# Altium project mainboard.PrjPcb
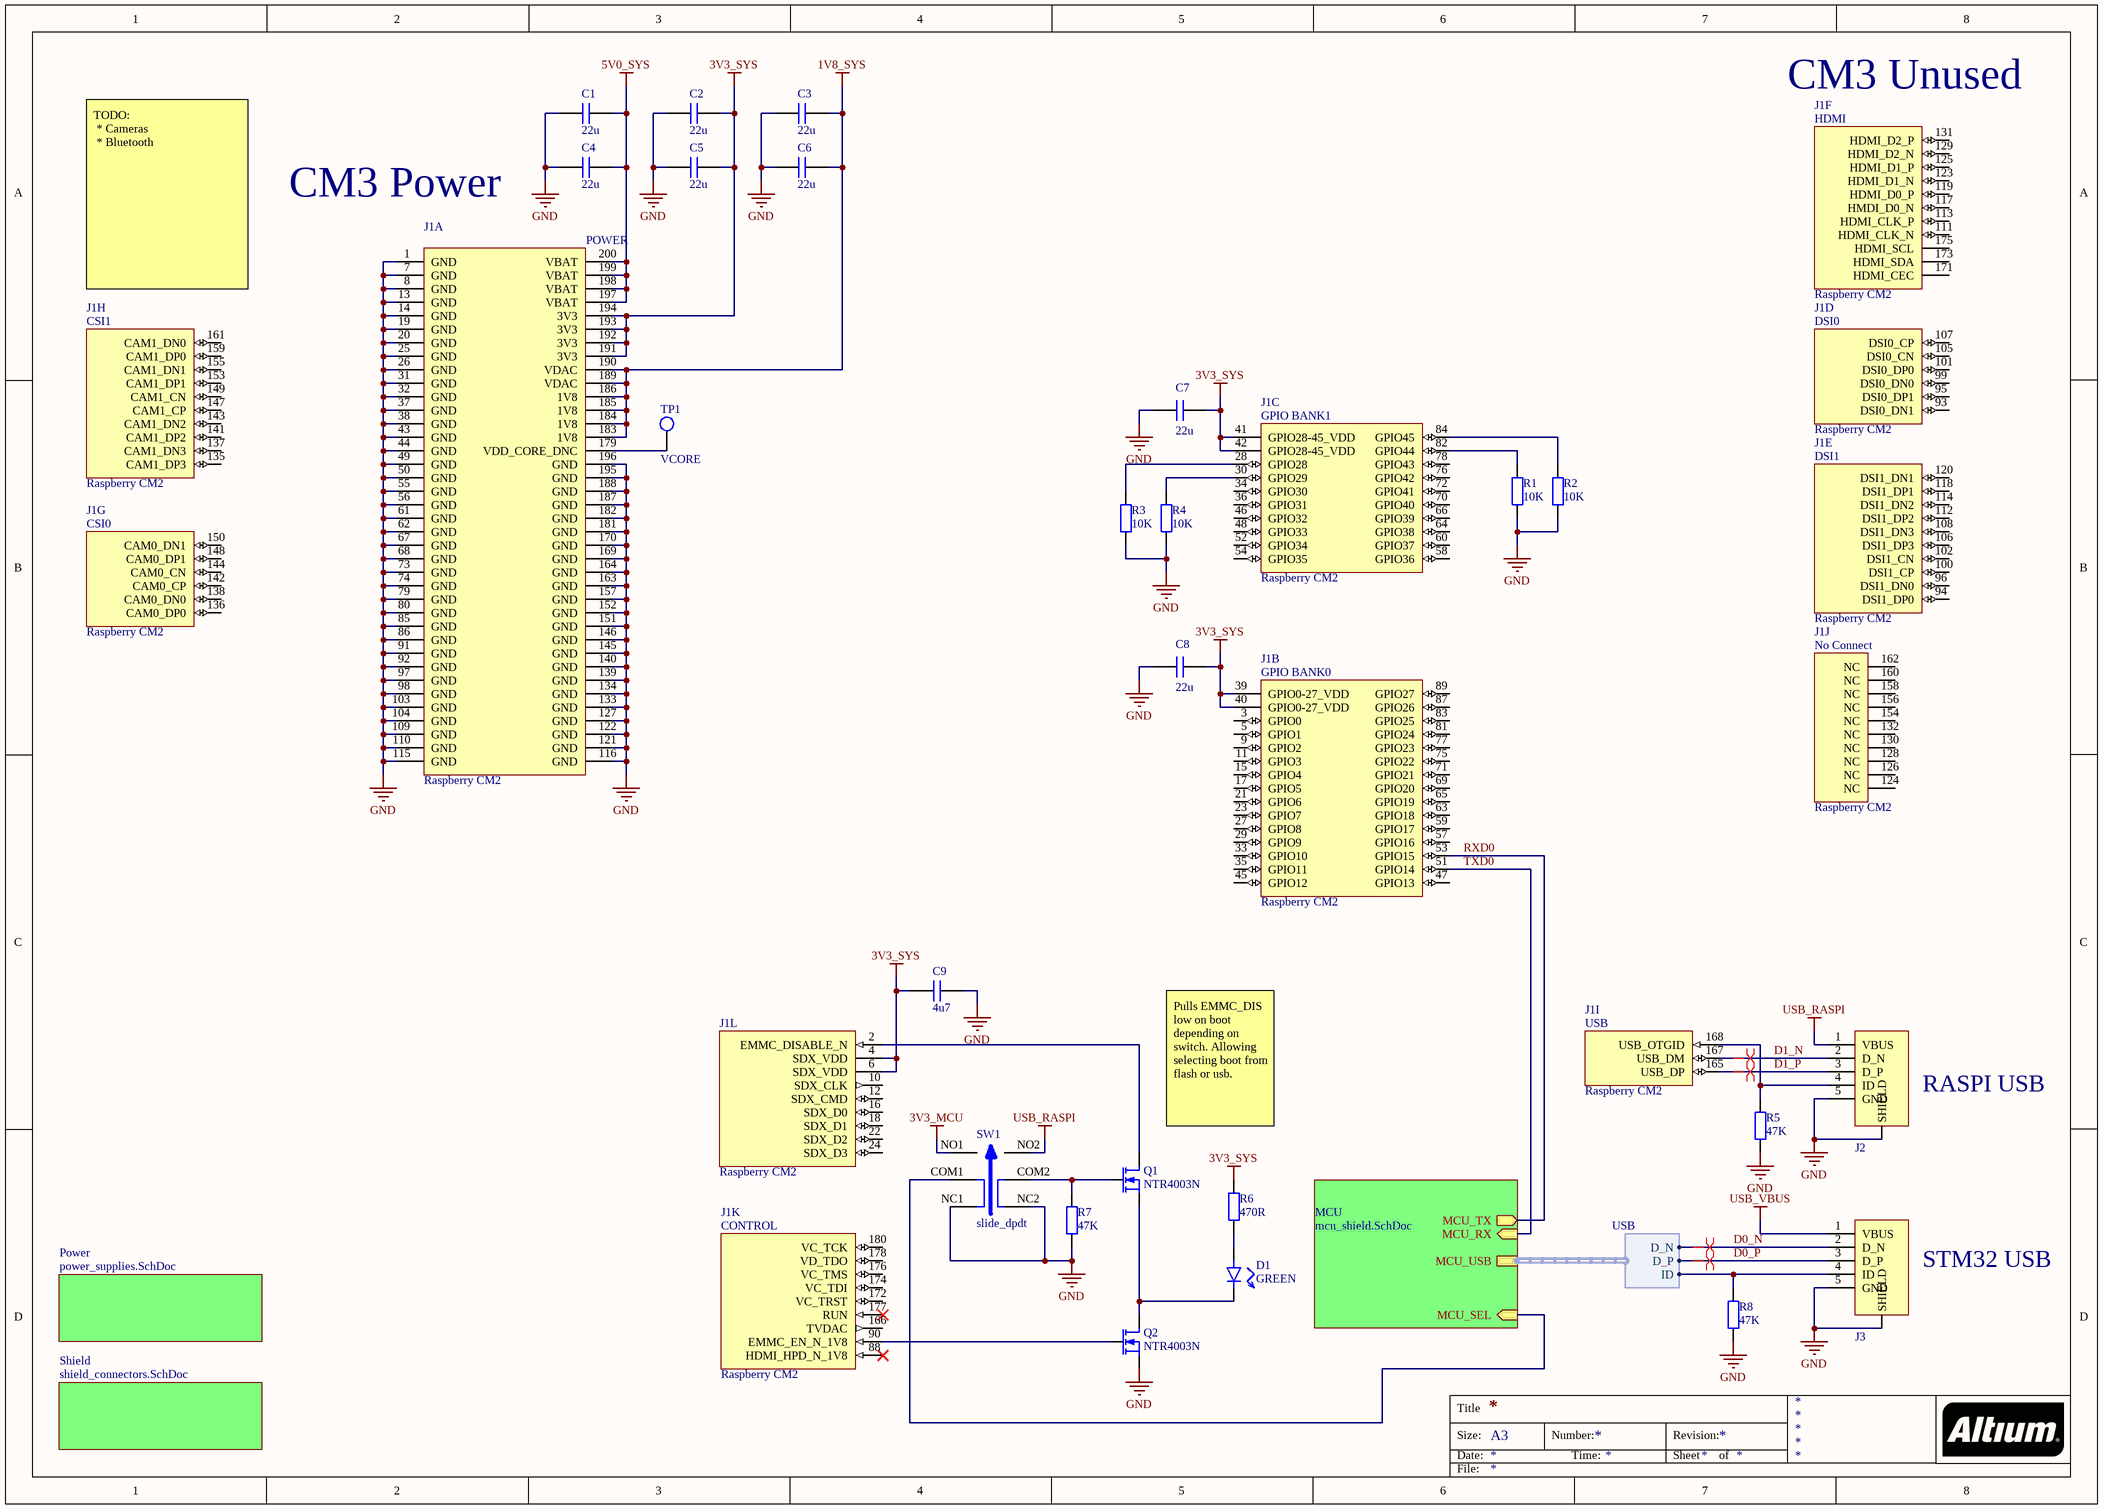
[diagram p0: mainboard.SchDoc]
5 sheets, 92 parts. Net scope: hierarchical (ports join the sheet entries above them; power ports are global).
Board file: mainboard.PcbDoc
Sheets:
  mainboard.SchDoc
    Power = power_supplies.SchDoc
      r5v0 = switchreg.SchDoc
      r3v3 = switchreg.SchDoc
      r1v8 = switchreg.SchDoc
    Shield = shield_connectors.SchDoc
    MCU = mcu_shield.SchDoc

## Sheet mainboard.SchDoc
size A3

### Parts
C1  value 22u  [CAPC2012X11N]  (hidden comment: cap)
C2  value 22u  [CAPC2012X11N]  (hidden comment: cap)
C3  value 22u  [CAPC2012X11N]  (hidden comment: cap)
C4  value 22u  [CAPC2012X11N]  (hidden comment: cap)
C5  value 22u  [CAPC2012X11N]  (hidden comment: cap)
C6  value 22u  [CAPC2012X11N]  (hidden comment: cap)
C7  value 22u  [CAPC2012X11N]  (hidden comment: cap)
C8  value 22u  [CAPC2012X11N]  (hidden comment: cap)
C9  value 4u7  [CAPC1608X08N]  (hidden comment: cap)
D1  value GREEN  [CAPCP1005X06N]  (hidden comment: led)
J1  Raspberry CM2  [raspi_cm3]  (parts A,B,C,D,E,F,G,H,I,J,K,L of 12)
J2  usb_micro  [usb_micro_10118192-0001LF]  (value not drawn)
J3  usb_micro  [usb_micro_10118192-0001LF]  (value not drawn)
Q1  NTR4003N  [SOT95P235X100-3N]
Q2  NTR4003N  [SOT95P235X100-3N]
R1  value 10K  [RESC1005X04N]  (hidden comment: res)
R2  value 10K  [RESC1005X04N]  (hidden comment: res)
R3  value 10K  [RESC1005X04N]  (hidden comment: res)
R4  value 10K  [RESC1005X04N]  (hidden comment: res)
R5  value 47K  [RESC1005X04N]  (hidden comment: res)
R6  value 470R  [RESC1005X04N]  (hidden comment: res)
R7  value 47K  [RESC1005X04N]  (hidden comment: res)
R8  value 47K  [RESC1005X04N]  (hidden comment: res)
SW1  slide_dpdt  [JS202011SCQN]
TP1  VCORE  [testpoint_smd]

### Sub-sheets
MCU = mcu_shield.SchDoc: MCU_SEL (in), MCU_USB (harness USB), MCU_TX (out), MCU_RX (in)
Power = power_supplies.SchDoc: no entries
Shield = shield_connectors.SchDoc: no entries

### Harnesses
USB: ID, D_N, D_P

### Nets
1V8_SYS: C3.1 C6.1 J1.183(1V8) J1.184(1V8) J1.185(1V8) J1.186(1V8) J1.189(VDAC) J1.190(VDAC)
3V3_MCU: SW1.NO1
3V3_SYS: C2.1 C5.1 C7.2 C8.2 C9.2 J1.4(SDX_VDD) J1.6(SDX_VDD) J1.39(GPIO0-27_VDD) J1.40(GPIO0-27_VDD) J1.41(GPIO28-45_VDD) J1.42(GPIO28-45_VDD) J1.191(3V3) J1.192(3V3) J1.193(3V3) J1.194(3V3) R6.2
5V0_SYS: C1.1 C4.1 J1.197(VBAT) J1.198(VBAT) J1.199(VBAT) J1.200(VBAT)
GND: C1.2 C2.2 C3.2 C4.2 C5.2 C6.2 C7.1 C8.1 C9.1 J1.1(GND) J1.7(GND) J1.8(GND) J1.13(GND) J1.14(GND) J1.19(GND) J1.20(GND) J1.25(GND) J1.26(GND) J1.31(GND) J1.32(GND) J1.37(GND) J1.38(GND) J1.43(GND) J1.44(GND) J1.49(GND) J1.50(GND) J1.55(GND) J1.56(GND) J1.61(GND) J1.62(GND) J1.67(GND) J1.68(GND) J1.73(GND) J1.74(GND) J1.79(GND) J1.80(GND) J1.85(GND) J1.86(GND) J1.91(GND) J1.92(GND) J1.97(GND) J1.98(GND) J1.103(GND) J1.104(GND) J1.109(GND) J1.110(GND) J1.115(GND) J1.116(GND) J1.121(GND) J1.122(GND) J1.127(GND) J1.133(GND) J1.134(GND) J1.139(GND) J1.140(GND) J1.145(GND) J1.146(GND) J1.151(GND) J1.152(GND) J1.157(GND) J1.163(GND) J1.164(GND) J1.169(GND) J1.170(GND) J1.181(GND) J1.182(GND) J1.187(GND) J1.188(GND) J1.195(GND) J1.196(GND) J2.5(GND) J2.SHIELD J3.5(GND) J3.SHIELD Q2.S R1.1 R2.1 R3.1 R4.1 R5.1 R7.2 R8.1 SW1.NC1 SW1.NC2
USB_RASPI: J2.1(VBUS) SW1.NO2
USB_VBUS: J3.1(VBUS)
D0_N: J3.2(D_N) ; sheet MCU/MCU_USB.D_N
D0_P: J3.3(D_P) ; sheet MCU/MCU_USB.D_P
D1_N: J1.167(USB_DM) J2.2(D_N)
D1_P: J1.165(USB_DP) J2.3(D_P)
RXD0: J1.53(GPIO15) ; sheet MCU/MCU_TX
TXD0: J1.51(GPIO14) ; sheet MCU/MCU_RX
NetD1_A: D1.A R6.1
NetD1_C: D1.C Q1.S Q2.D
NetJ1_2: J1.2(EMMC_DISABLE_N) Q1.D
NetJ1_28: J1.28(GPIO28) R3.2
NetJ1_30: J1.30(GPIO29) R4.2
NetJ1_82: J1.82(GPIO44) R1.2
NetJ1_84: J1.84(GPIO45) R2.2
NetJ1_90: J1.90(EMMC_EN_N_1V8) Q2.G
NetJ1_168: J1.168(USB_OTGID) J2.4(ID) R5.2
NetJ1_179: J1.179(VDD_CORE_DNC) TP1.1
NetJ3_4: J3.4(ID) R8.2 ; sheet MCU/MCU_USB.ID
NetQ1_G: Q1.G R7.1 SW1.COM2
NetR12_2: SW1.COM1 ; sheet MCU/MCU_SEL

Not connected (* = marked no-connect by the designer): J1 3(GPIO0) 5(GPIO1) 9(GPIO2) 10(SDX_CLK) 11(GPIO3) 12(SDX_CMD) 15(GPIO4) 16(SDX_D0) 17(GPIO5) 18(SDX_D1) 21(GPIO6) 22(SDX_D2) 23(GPIO7) 24(SDX_D3) 27(GPIO8) 29(GPIO9) 33(GPIO10) 34(GPIO30) 35(GPIO11) 36(GPIO31) 45(GPIO12) 46(GPIO32) 47(GPIO13) 48(GPIO33) 52(GPIO34) 54(GPIO35) 57(GPIO16) 58(GPIO36) 59(GPIO17) 60(GPIO37) 63(GPIO18) 64(GPIO38) 65(GPIO19) 66(GPIO39) 69(GPIO20) 70(GPIO40) 71(GPIO21) 72(GPIO41) 75(GPIO22) 76(GPIO42) 77(GPIO23) 78(GPIO43) 81(GPIO24) 83(GPIO25) 87(GPIO26) 88(HDMI_HPD_N_1V8)* 89(GPIO27) 93(DSI0_DN1) 94(DSI1_DP0) 95(DSI0_DP1) 96(DSI1_DN0) 99(DSI0_DN0) 100(DSI1_CP) 101(DSI0_DP0) 102(DSI1_CN) 105(DSI0_CN) 106(DSI1_DP3) 107(DSI0_CP) 108(DSI1_DN3) 111(HDMI_CLK_N) 112(DSI1_DP2) 113(HDMI_CLK_P) 114(DSI1_DN2) 117(HMDI_D0_N) 118(DSI1_DP1) 119(HDMI_D0_P) 120(DSI1_DN1) 123(HDMI_D1_N) 124(NC) 125(HDMI_D1_P) 126(NC) 128(NC) 129(HDMI_D2_N) 130(NC) 131(HDMI_D2_P) 132(NC) 135(CAM1_DP3) 136(CAM0_DP0) 137(CAM1_DN3) 138(CAM0_DN0) 141(CAM1_DP2) 142(CAM0_CP) 143(CAM1_DN2) 144(CAM0_CN) 147(CAM1_CP) 148(CAM0_DP1) 149(CAM1_CN) 150(CAM0_DN1) 153(CAM1_DP1) 154(NC) 155(CAM1_DN1) 156(NC) 158(NC) 159(CAM1_DP0) 160(NC) 161(CAM1_DN0) 162(NC) 166(TVDAC) 171(HDMI_CEC) 172(VC_TRST) 173(HDMI_SDA) 174(VC_TDI) 175(HDMI_SCL) 176(VC_TMS) 177(RUN)* 178(VD_TDO) 180(VC_TCK)

### Layout directives
differential pair: D0_N, D0_P, D1_N, D1_P

### Notes on the sheet
- (near J1) CM3 Unused
- CM3 Power
- TODO:
  * Cameras
  * Bluetooth
- Pulls EMMC_DIS low on boot depending on switch. Allowing selecting boot from flash or usb.
- (near J2) RASPI USB
- (near J3) STM32 USB
- Title
- Size:
- Date:
- A3
- Number:
- Time:
- Revision:
- Sheet
- of
- File:
- (in symbol raspicm2, part A) POWER
- (in symbol raspicm2, part B) GPIO BANK0
- (in symbol raspicm2, part C) GPIO BANK1
- (in symbol raspicm2, part D) DSI0
- (in symbol raspicm2, part E) DSI1
- (in symbol raspicm2, part F) HDMI
- (in symbol raspicm2, part G) CSI0
- (in symbol raspicm2, part H) CSI1
- (in symbol raspicm2, part I) USB
- (in symbol raspicm2, part J) No Connect
- (in symbol raspicm2, part K) CONTROL

### Library data of the parts
C1-C9 = cap: Capacitor
D1 = led: pin to pad: A>1 C>2
J1 = raspicm2
J2 J3 = usb_micro: Micro USB Receptacle
Q1 Q2 = ntr4003n: N-channel Mosfet
R1-R8 = res: Resistor
SW1 = slide_dpdt: DPDT
TP1 = testpoint: Test point

## Sheet power_supplies.SchDoc
size A4
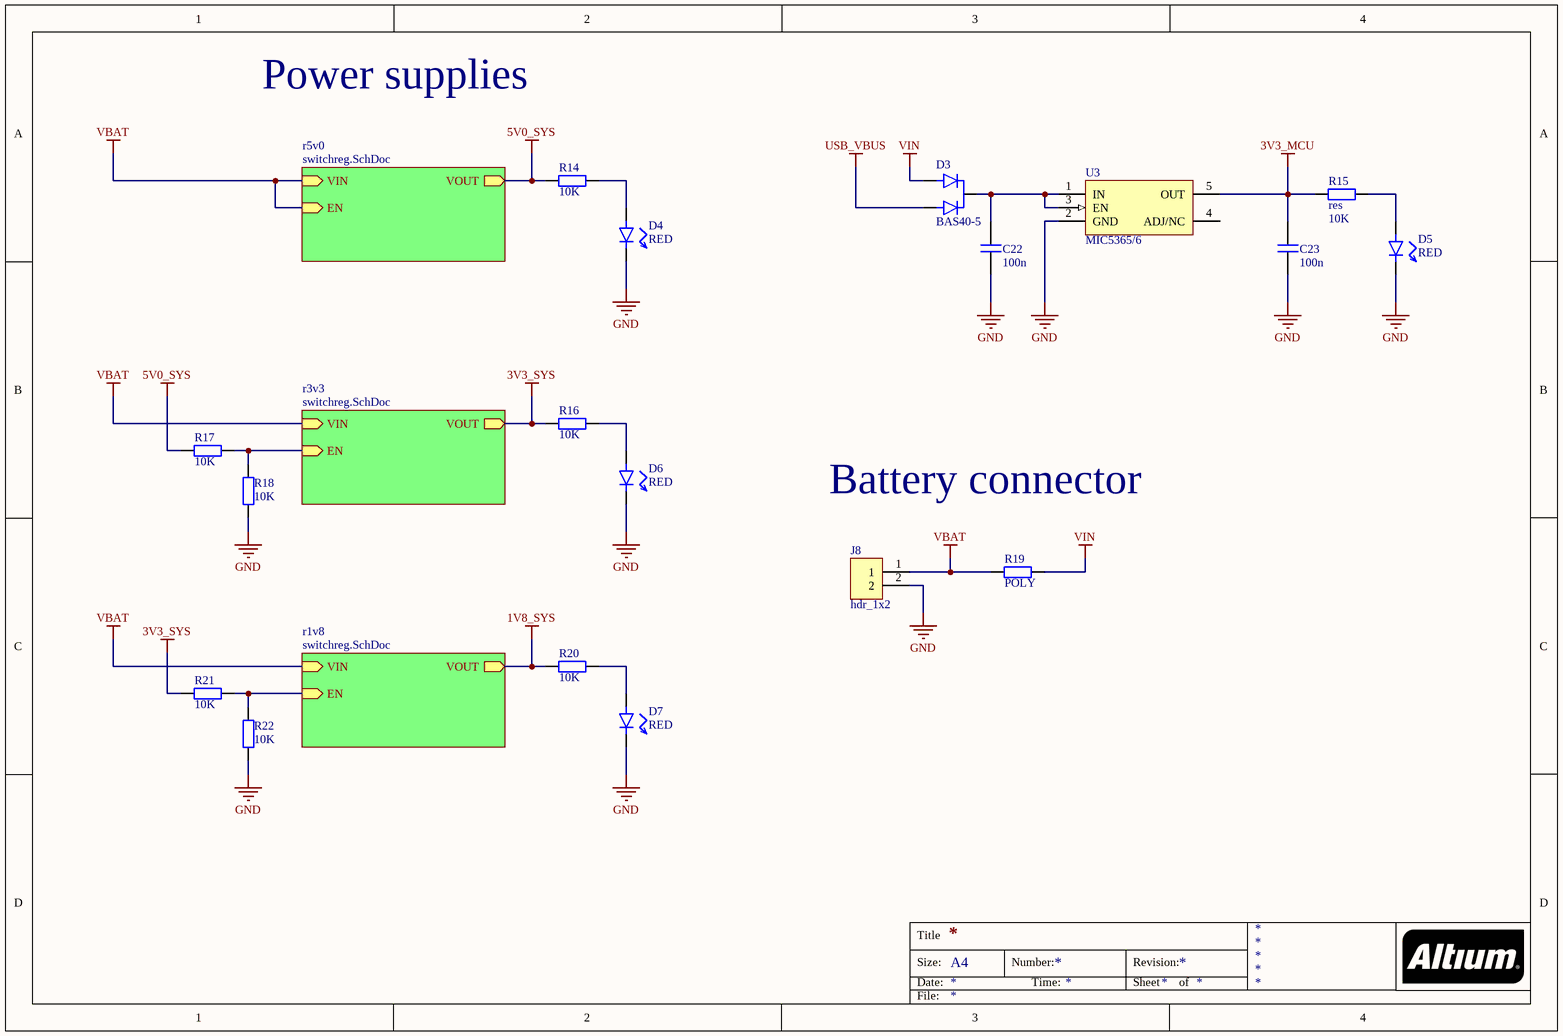
[diagram p1: power_supplies.SchDoc]

### Parts
C22  value 100n  [CAPC1005X06N]  (hidden comment: cap)
C23  value 100n  [CAPC1005X06N]  (hidden comment: cap)
D3  BAS40-5  [SOT23_CC]
D4  value RED  [CAPCP1005X06N]  (hidden comment: led)
D5  value RED  [CAPCP1005X06N]  (hidden comment: led)
D6  value RED  [CAPCP1005X06N]  (hidden comment: led)
D7  value RED  [CAPCP1005X06N]  (hidden comment: led)
J8  hdr_1x2  [hdr_1x2_200mil]
R14  value 10K  [RESC1005X04N]  (hidden comment: res)
R15  res  value 10K  [RESC1005X04N]
R16  value 10K  [RESC1005X04N]  (hidden comment: res)
R17  value 10K  [RESC1005X04N]  (hidden comment: res)
R18  value 10K  [RESC1005X04N]  (hidden comment: res)
R19  value POLY  [RESC2012X06N]  (hidden comment: res)
R20  value 10K  [RESC1005X04N]  (hidden comment: res)
R21  value 10K  [RESC1005X04N]  (hidden comment: res)
R22  value 10K  [RESC1005X04N]  (hidden comment: res)
U3  MIC5365/6  [SOT65P210X110-5N]

### Sub-sheets
r1v8 = switchreg.SchDoc: VIN (in), VOUT (out), EN (in)
r3v3 = switchreg.SchDoc: VIN (in), VOUT (out), EN (in)
r5v0 = switchreg.SchDoc: VIN (in), VOUT (out), EN (in)

### Nets
1V8_SYS: R20.1 ; sheet r1v8/VOUT
3V3_MCU: C23.2 R15.1 U3.5(OUT)
3V3_SYS: R16.1 R21.1 ; sheet r3v3/VOUT
5V0_SYS: R14.1 R17.1 ; sheet r5v0/VOUT
GND: C22.1 C23.1 D4.C D5.C D6.C D7.C J8.2 R18.1 R22.1 U3.2(GND)
USB_VBUS: D3.A2
VBAT: J8.1 R19.1 ; sheet r5v0/VIN, sheet r5v0/EN, sheet r3v3/VIN, sheet r1v8/VIN
VIN: D3.A1 R19.2
NetC22_2: C22.2 D3.C U3.1(IN) U3.3(EN)
NetD4_A: D4.A R14.2
NetD5_A: D5.A R15.2
NetD6_A: D6.A R16.2
NetD7_A: D7.A R20.2
NetR17_2: R17.2 R18.2 ; sheet r3v3/EN
NetR21_2: R21.2 R22.2 ; sheet r1v8/EN

Not connected (* = marked no-connect by the designer): U3 4(ADJ/NC)

### Notes on the sheet
- Power supplies
- Battery connector
- Title
- Size:
- Date:
- A4
- Number:
- Time:
- Revision:
- Sheet
- of
- File:

### Library data of the parts
C22 C23 = cap: Capacitor
D3 = diode_dual_cc: Diode Common Cathode
D4-D7 = led: pin to pad: A>1 C>2
J8 = hdr_1x2: 1x2 Header
R14-R22 = res: Resistor
U3 = mic5365: 5pin voltage regulator

## Sheet switchreg.SchDoc
size A4
Used 3 times, as channels Power/r5v0, Power/r3v3, Power/r1v8. Parts and nets are listed once, with the designators drawn on the sheet.
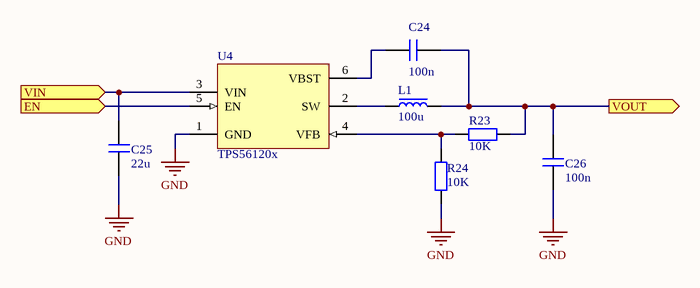
[diagram p2: switchreg.SchDoc]

### Parts
C24  value 100n  [CAPC1005X06N]  (hidden comment: cap)
C25  value 22u  [CAPC2012X11N]  (hidden comment: cap)
C26  value 100n  [CAPC2012X11N]  (hidden comment: cap)
L1  value 100u  [INDC4040X18N]  (hidden comment: inds)
R23  value 10K  [RESC1005X04N]  (hidden comment: res)
R24  value 10K  [RESC1005X04N]  (hidden comment: res)
U4  TPS56120x  [SOT95P280X110-6N]

### Ports
EN (in), VIN (in), VOUT (out)

### Nets
GND: C25.1 C26.1 R24.1 U4.1(GND)
EN: U4.5(EN) ; port EN
VIN: C25.2 U4.3(VIN) ; port VIN
VOUT: C24.2 C26.2 L1.2 R23.2 ; port VOUT
NetC24_1: C24.1 U4.6(VBST)
NetL1_1: L1.1 U4.2(SW)
NetR23_1: R23.1 R24.2 U4.4(VFB)

### Channels
Power/r5v0: designators end in _r5v0; ports EN=VBAT VIN=VBAT VOUT=5V0_SYS
Power/r3v3: designators end in _r3v3; ports EN=NetR17_2 VIN=VBAT VOUT=3V3_SYS
Power/r1v8: designators end in _r1v8; ports EN=NetR21_2 VIN=VBAT VOUT=1V8_SYS

### Notes on the sheet
- Title
- Size:
- Date:
- A4
- Number:
- Time:
- Revision:
- Sheet
- of
- File:

### Library data of the parts
C24-C26 = cap: Capacitor
L1 = inds: Inductor
R23 R24 = res: Resistor
U4 = tps56120x: 4.5-V to 17-V Input, 1-A Synchronous  Step-Down  Voltage  Regulator  in 6-Pin  SOT-23

## Sheet shield_connectors.SchDoc
size A

## Sheet mcu_shield.SchDoc
size A4
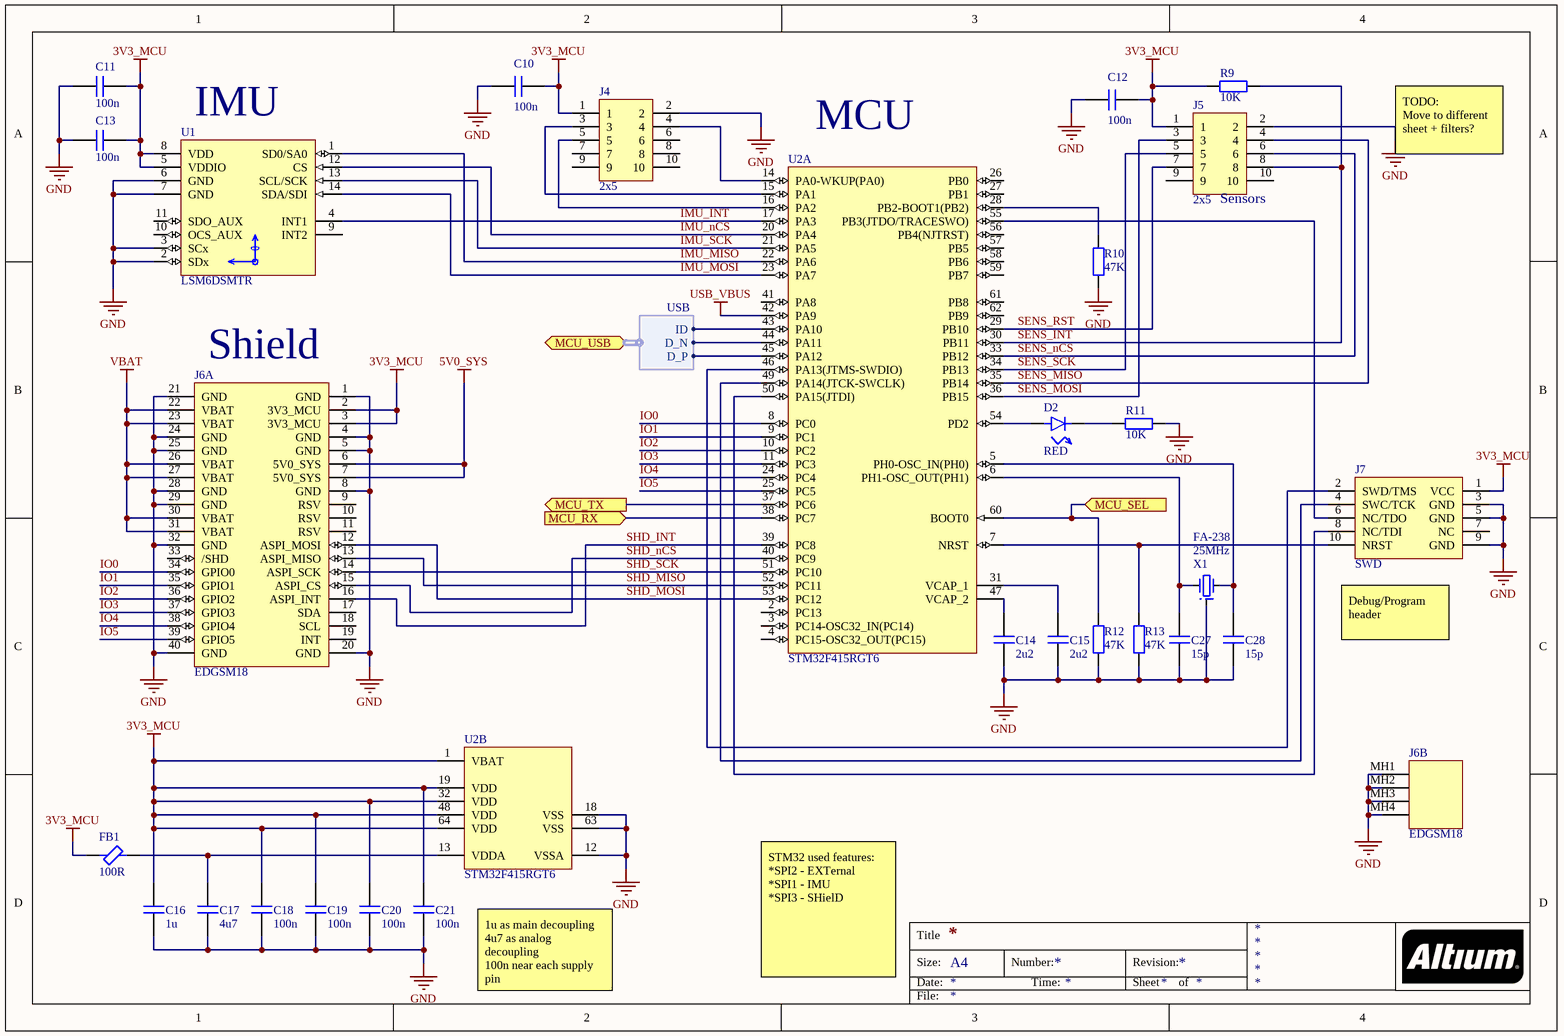
[diagram p3: mcu_shield.SchDoc]

### Parts
C10  value 100n  [CAPC1005X06N]  (hidden comment: cap)
C11  value 100n  [CAPC1005X06N]  (hidden comment: cap)
C12  value 100n  [CAPC1005X06N]  (hidden comment: cap)
C13  value 100n  [CAPC1005X06N]  (hidden comment: cap)
C14  value 2u2  [CAPC1608X08N]  (hidden comment: cap)
C15  value 2u2  [CAPC1608X08N]  (hidden comment: cap)
C16  value 1u  [CAPC1608X08N]  (hidden comment: cap)
C17  value 4u7  [CAPC1608X08N]  (hidden comment: cap)
C18  value 100n  [CAPC1005X06N]  (hidden comment: cap)
C19  value 100n  [CAPC1005X06N]  (hidden comment: cap)
C20  value 100n  [CAPC1005X06N]  (hidden comment: cap)
C21  value 100n  [CAPC1005X06N]  (hidden comment: cap)
C27  value 15p  [CAPC1005X06N]  (hidden comment: cap)
C28  value 15p  [CAPC1005X06N]  (hidden comment: cap)
D2  value RED  [CAPCP1005X06N]  (hidden comment: diode)
FB1  value 100R  [INDC1608X08N]  (hidden comment: ferrite)
J4  2x5  [hdr_2x5_50mil]
J5  2x5  [hdr_2x5_50mil]
J6  EDGSM18  [edgsm_shield]  (parts A,B of 2)
J7  SWD  [hdr_2x5_50mil]
R9  value 10K  [RESC1005X04N]  (hidden comment: res)
R10  value 47K  [RESC1005X04N]  (hidden comment: res)
R11  value 10K  [RESC1005X04N]  (hidden comment: res)
R12  value 47K  [RESC1005X04N]  (hidden comment: res)
R13  value 47K  [RESC1005X04N]  (hidden comment: res)
U1  LSM6DSMTR  [QFN50P300X250X86-14N]
U2  STM32F415RGT6  [STM-LQFP64_N]  (parts A,B of 2)
X1  FA-238  freq: 25MHz  [DFN220P320X70-4N]

### Ports
MCU_RX (in), MCU_SEL (in), MCU_TX (out), MCU_USB (harness USB)

### Harnesses
USB: D_N, D_P, ID

### Nets
3V3_MCU: C10.2 C11.1 C12.2 C13.1 C16.2 C18.2 C19.2 C20.2 C21.2 FB1.1 J4.1 J5.1 J6.2(3V3_MCU) J6.3(3V3_MCU) J7.1(VCC) R9.2 U1.5(VDDIO) U1.8(VDD) U2.1(VBAT) U2.19(VDD) U2.32(VDD) U2.48(VDD) U2.64(VDD)
5V0_SYS: J6.6(5V0_SYS) J6.7(5V0_SYS)
GND: C10.1 C11.2 C12.1 C13.2 C14.1 C15.1 C16.1 C17.1 C18.1 C19.1 C20.1 C21.1 C27.1 C28.1 J4.2 J5.2 J6.1(GND) J6.4(GND) J6.5(GND) J6.8(GND) J6.20(GND) J6.21(GND) J6.24(GND) J6.25(GND) J6.28(GND) J6.29(GND) J6.32(GND) J6.40(GND) J6.MH1 J6.MH2 J6.MH3 J6.MH4 J7.3(GND) J7.5(GND) J7.9(GND) R10.1 R11.2 R12.1 R13.1 U1.2(SDx) U1.3(SCx) U1.6(GND) U1.7(GND) U2.12(VSSA) U2.18(VSS) U2.63(VSS) X1.SHIELD
USB_VBUS: U2.42(PA9)
VBAT: J6.22(VBAT) J6.23(VBAT) J6.26(VBAT) J6.27(VBAT) J6.30(VBAT) J6.31(VBAT)
D0_N: U2.44(PA11) ; port MCU_USB.D_N
D0_P: U2.45(PA12) ; port MCU_USB.D_P
IMU_INT: U1.4(INT1) U2.17(PA3)
IMU_MISO: U1.1(SD0/SA0) U2.22(PA6)
IMU_MOSI: U1.14(SDA/SDI) U2.23(PA7)
IMU_nCS: U1.12(CS) U2.20(PA4)
IMU_SCK: U1.13(SCL/SCK) U2.21(PA5)
IO0: J6.34(GPIO0) U2.8(PC0)
IO1: J6.35(GPIO1) U2.9(PC1)
IO2: J6.36(GPIO2) U2.10(PC2)
IO3: J6.37(GPIO3) U2.11(PC3)
IO4: J6.38(GPIO4) U2.24(PC4)
IO5: J6.39(GPIO5) U2.25(PC5)
RXD0: U2.37(PC6) ; port MCU_TX
SENS_INT: J5.8 R9.1 U2.30(PB11)
SENS_MISO: J5.4 U2.35(PB14)
SENS_MOSI: J5.3 U2.36(PB15)
SENS_nCS: J5.6 U2.33(PB12)
SENS_RST: J5.7 U2.29(PB10)
SENS_SCK: J5.5 U2.34(PB13)
SHD_INT: J6.16(ASPI_INT) U2.39(PC8)
SHD_MISO: J6.13(ASPI_MISO) U2.52(PC11)
SHD_MOSI: J6.12(ASPI_MOSI) U2.53(PC12)
SHD_nCS: J6.15(ASPI_CS) U2.40(PC9)
SHD_SCK: J6.14(ASPI_SCK) U2.51(PC10)
TXD0: U2.38(PC7) ; port MCU_RX
NetC14_2: C14.2 U2.47(VCAP_2)
NetC15_2: C15.2 U2.31(VCAP_1)
NetC17_2: C17.2 FB1.2 U2.13(VDDA)
NetC27_2: C27.2 U2.6(PH1-OSC_OUT(PH1)) X1.1
NetC28_2: C28.2 U2.5(PH0-OSC_IN(PH0)) X1.2
NetD2_A: D2.A U2.54(PD2)
NetD2_C: D2.C R11.1
NetJ3_4: U2.43(PA10) ; port MCU_USB.ID
NetJ4_3: J4.3 U2.15(PA1)
NetJ4_4: J4.4 U2.14(PA0-WKUP(PA0))
NetJ4_5: J4.5 U2.16(PA2)
NetJ7_2: J7.2(SWD/TMS) U2.46(PA13(JTMS-SWDIO))
NetJ7_4: J7.4(SWC/TCK) U2.49(PA14(JTCK-SWCLK))
NetJ7_6: J7.6(NC/TDO) U2.55(PB3(JTDO/TRACESWO))
NetJ7_8: J7.8(NC/TDI) U2.50(PA15(JTDI))
NetJ7_10: J7.10(NRST) R13.2 U2.7(NRST)
NetR10_2: R10.2 U2.28(PB2-BOOT1(PB2))
NetR12_2: R12.2 U2.60(BOOT0) ; port MCU_SEL

Not connected (* = marked no-connect by the designer): J4 6 7 8 9 10; J5 9 10; J6 9(RSV) 10(RSV) 11(RSV) 17(SDA) 18(SCL) 19(INT) 33(/SHD); J7 7(NC); U1 9(INT2) 10(OCS_AUX) 11(SDO_AUX); U2 2(PC13) 3(PC14-OSC32_IN(PC14)) 4(PC15-OSC32_OUT(PC15)) 26(PB0) 27(PB1) 41(PA8) 56(PB4(NJTRST)) 57(PB5) 58(PB6) 59(PB7) 61(PB8) 62(PB9)

### Notes on the sheet
- (near U1) IMU
- (near U2) MCU
- TODO:
  Move to different sheet + filters?
- (near J5) Sensors
- (near J6) Shield
- (near J7) Debug/Program header
- 1u as main decoupling
  4u7 as analog decoupling
  100n near each supply pin
- STM32 used features:
  *SPI2 - EXTernal
  *SPI1 - IMU
  *SPI3 - SHielD
- Title
- Size:
- Date:
- A4
- Number:
- Time:
- Revision:
- Sheet
- of
- File:

### Library data of the parts
C10-C21 C27 C28 = cap: Capacitor
D2 = diode: pin to pad: A>1 C>2
FB1 = ferrite: Inductor
J4 J5 = hdr_2x5: 2x5 Header
J6 = edgsm18_shield
J7 = hdr_swd: SWD Header
R9-R13 = res: Resistor
U1 = lsm6dsmtr: 6DOF IMU acc+gyro
U2 = STM32F415RGT6: ARM Cortex-M4 32-bit MCU+FPU, 210 DMIPS, 1024 kB Flash, 192 kB Internal RAM, 51 I/Os, 64-pin LQFP, -40 to 85 degC, Tray; Manufacturer: STMicroelectronics; D/A Converter: 2x12-bit; FLASH Size (Prog) (kB): 1024; I/Os (High Current): 51; Internal RAM Size (kB): 192; Operating Frequency(F) (Processor speed) (MHz): 168; Supply Voltage(Vcc) max (V): 3.6; Supply Voltage(Vcc) min (V): 1.8; DatasheetVersion: Rev. 4; PackageVersion: Rev. 4, 06/2013; PackageReference: LQFP64; PackageDescription: 64-Pin Low Profile Quad Flat Package, 10 x 10 mm Body, 0.5 mm Pitch; Supplier 1: Digi-Key; Supplier Part Number 1: 497-11907-ND; Supplier 2: Farnell; Supplier Part Number 2: 2064370; Supplier 3: Newark; Supplier Part Number 3: 73T2335; Supplier 4: Mouser; Supplier Part Number 4: 511-STM32F415RGT6; Core: ARM Cortex-M4; Packing: Tray; Mounting Technology: Surface Mount; PartNumber: STM32F415RGT6; ComponentLink1Description: Manufacturer URL; ComponentLink1URL: http://www.st.com/web/en/home.html; ComponentLink2Description: Datasheet; ComponentLink2URL: http://www.st.com/st-web-ui/static/active/en/resource/technical/document/datasheet/DM00035129.pdf; ComponentLink3Description: Package Specification; ComponentLink3URL: http://www.st.com/st-web-ui/static/active/en/resource/technical/document/datasheet/DM00037051.pdf
X1 = crystal: Crystal With Shield

## Nets that join several sheets
1V8_SYS: mainboard (8 pins), power_supplies (R20.1), Power/r1v8 (C24_r1v8.2 C26_r1v8.2 L1_r1v8.2 R23_r1v8.2)
3V3_MCU: mainboard (SW1.NO1), power_supplies (C23.2 R15.1 U3.5), mcu_shield (23 pins)
3V3_SYS: mainboard (16 pins), power_supplies (R16.1 R21.1), Power/r3v3 (C24_r3v3.2 C26_r3v3.2 L1_r3v3.2 R23_r3v3.2)
5V0_SYS: mainboard (6 pins), power_supplies (R14.1 R17.1), Power/r5v0 (C24_r5v0.2 C26_r5v0.2 L1_r5v0.2 R23_r5v0.2), mcu_shield (J6.6 J6.7)
GND: mainboard (84 pins), power_supplies (10 pins), Power/r5v0 (C25_r5v0.1 C26_r5v0.1 R24_r5v0.1 U4_r5v0.1), Power/r3v3 (C25_r3v3.1 C26_r3v3.1 R24_r3v3.1 U4_r3v3.1), Power/r1v8 (C25_r1v8.1 C26_r1v8.1 R24_r1v8.1 U4_r1v8.1), mcu_shield (47 pins)
USB_VBUS: mainboard (J3.1), power_supplies (D3.A2), mcu_shield (U2.42)
VBAT: power_supplies (J8.1 R19.1), Power/r5v0 (C25_r5v0.2 U4_r5v0.3 U4_r5v0.5), Power/r3v3 (C25_r3v3.2 U4_r3v3.3), Power/r1v8 (C25_r1v8.2 U4_r1v8.3), mcu_shield (6 pins)
D0_N: mainboard (J3.2), mcu_shield (U2.44)
D0_P: mainboard (J3.3), mcu_shield (U2.45)
NetJ3_4: mainboard (J3.4 R8.2), mcu_shield (U2.43)
NetR12_2: mainboard (SW1.COM1), mcu_shield (R12.2 U2.60)
NetR17_2: power_supplies (R17.2 R18.2), Power/r3v3 (U4_r3v3.5)
NetR21_2: power_supplies (R21.2 R22.2), Power/r1v8 (U4_r1v8.5)
RXD0: mainboard (J1.53), mcu_shield (U2.37)
TXD0: mainboard (J1.51), mcu_shield (U2.38)